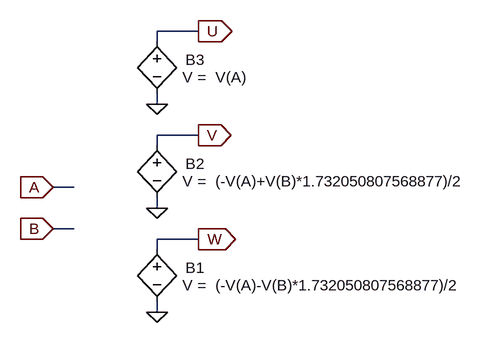
[diagram p0: schematic inv_clarke.asc]
inv_clarke.asc, the LTspice schematic file:
Version 4
SHEET 1 880 680
WIRE 240 -160 176 -160
WIRE 176 -144 176 -160
WIRE 176 -48 176 -64
WIRE 240 0 176 0
WIRE 176 16 176 0
WIRE 48 80 16 80
WIRE 176 112 176 96
WIRE 48 144 16 144
WIRE 240 160 176 160
WIRE 176 176 176 160
WIRE 176 272 176 256
FLAG 16 80 A
IOPIN 16 80 In
FLAG 16 144 B
IOPIN 16 144 In
FLAG 176 272 0
FLAG 240 160 W
IOPIN 240 160 Out
FLAG 176 112 0
FLAG 240 0 V
IOPIN 240 0 Out
FLAG 176 -48 0
FLAG 240 -160 U
IOPIN 240 -160 Out
SYMBOL bv 176 160 R0
WINDOW 0 44 44 Left 0
WINDOW 3 39 71 Left 0
SYMATTR InstName B1
SYMATTR Value V =  (-V(A)-V(B)*1.732050807568877)/2
SYMBOL bv 176 0 R0
WINDOW 0 44 44 Left 0
WINDOW 3 39 71 Left 0
SYMATTR InstName B2
SYMATTR Value V =  (-V(A)+V(B)*1.732050807568877)/2
SYMBOL bv 176 -160 R0
WINDOW 0 44 44 Left 0
WINDOW 3 39 71 Left 0
SYMATTR InstName B3
SYMATTR Value V =  V(A)

The netlist it stands for:
* inv_clarke.asc
B1 W 0 V =  (-V(A)-V(B)*1.732050807568877)/2
B2 V 0 V =  (-V(A)+V(B)*1.732050807568877)/2
B3 U 0 V =  V(A)
.backanno
.end